# Altium schematic sheet E-18 Ultrasonic.SchDoc: E-18 Ultrasonic
size B; DrawnBy: Jeremie Boulianne; Organization: Synthiam Inc.; Address1: Unit 10, 6120 - 11 St. SE; Address2: Calgary, AB; Address3: T2H 2L7; Address4: Canada
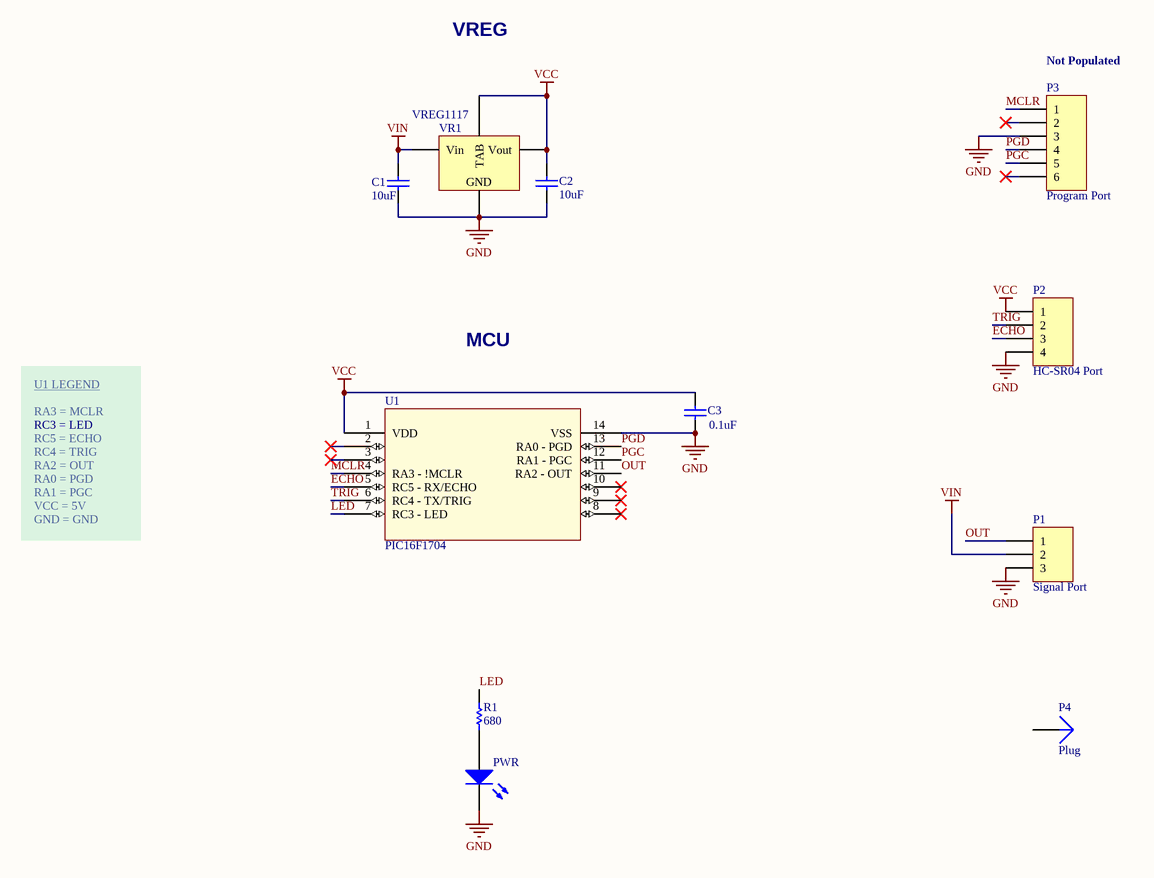
[diagram p0: E-18 Ultrasonic.SchDoc]

## Parts
C1  value 10uF  [0805]  (hidden comment: Cap)
C2  value 10uF  [0805]  (hidden comment: Cap)
C3  value 0.1uF  [0805 TIGHT]  (hidden comment: 18pF)
P1  Signal Port  [HDR1X3]
P2  HC-SR04 Port  [HDR1X4]
P3  Program Port  [HDR1X6]
P4  Plug  [PIN1]
PWR  LED1  [0805 LED - TIGHT]  (value not drawn)
R1  value 680  [0805 TIGHT]  (hidden comment: Res1)
U1  PIC16F1704
VR1  VREG1117  [VREG1117]

## Nets
GND: C1.2 C2.2 C3.1 P1.3 P2.4 P3.3 PWR.2(K) U1.14(VSS) VR1.1(GND)
VCC: C2.1 C3.2 P2.1 U1.1(VDD) VR1.2(Vout)
VIN: C1.1 P1.2 VR1.3(Vin)
ECHO: P2.3 U1.5(RC5_-_RX/ECHO)
LED: R1.2 U1.7(RC3_-_LED)
MCLR: P3.1 U1.4(RA3_-_!MCLR)
OUT: P1.1 U1.11(RA2_-_OUT)
PGC: P3.5 U1.12(RA1_-_PGC)
PGD: P3.4 U1.13(RA0_-_PGD)
TRIG: P2.2 U1.6(RC4_-_TX/TRIG)
NetPWR_1: PWR.1(A) R1.1

Not connected (* = marked no-connect by the designer): P3 2* 6*; P4 1; U1 2(RA5)* 3(RA4)* 8(RC2)* 9(RC1)* 10(RC0)*

## Notes on the sheet
- VREG
- (near P3) Not Populated
- U1 LEGEND
- MCU
- RA3 = MCLR
- RC5 = ECHO
- RC4 = TRIG
- RC3 = LED
- RA2 = OUT
- RA1 = PGC
- RA0 = PGD
- VCC = 5V
- GND = GND
- Property of:
- Size:
- Date:
- B
- Drawn By:
- Time:
- Revision:
- Copyright © 2019 Synthiam Inc. All rights reserved.

## Library data of the parts
C1-C3 = Cap: Capacitor; Published: 8-Jun-2000; LatestRevisionDate: 17-Jul-2002; LatestRevisionNote: Re-released for DXP Platform.; PackageReference: RAD-0.3; Publisher: Altium Limited
P1 = Header 3: Header, 3-Pin; LatestRevisionDate: 17-Jul-2002; LatestRevisionNote: Re-released for DXP Platform.; Publisher: Altium Limited
P2 = Header 4: Header, 4-Pin; LatestRevisionDate: 17-Jul-2002; LatestRevisionNote: Re-released for DXP Platform.; Publisher: Altium Limited
P3 = Header 6: Header, 6-Pin; LatestRevisionDate: 17-Jul-2002; LatestRevisionNote: Re-released for DXP Platform.; Publisher: Altium Limited
PWR = LED1: Typical RED GaAs LED; Published: 8-Jun-2000; LatestRevisionDate: 08-Jul-2005; LatestRevisionNote: Mech Layer 1 removed.; PackageReference: LED-1; Publisher: Altium Limited
R1 = Res1: Resistor; Published: 8-Jun-2000; LatestRevisionDate: 17-Jul-2002; LatestRevisionNote: Re-released for DXP Platform.; PackageReference: AXIAL-0.3; Publisher: Altium Limited
U1 = PIC16F1704 - Ultrasonic
P4 = Plug: LatestRevisionDate: 17-Jul-2002; LatestRevisionNote: Re-released for DXP Platform.; Publisher: Altium Limited